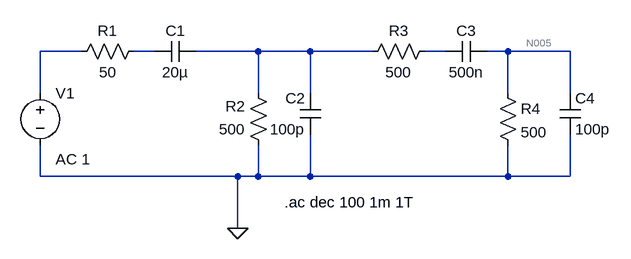
[diagram p0: schematic Question_1.asc]
Question_1.asc, the LTspice schematic file:
Version 4
SHEET 1 1124 680
WIRE 304 160 240 160
WIRE 416 160 384 160
WIRE 576 160 480 160
WIRE 656 160 576 160
WIRE 752 160 656 160
WIRE 864 160 832 160
WIRE 960 160 928 160
WIRE 1056 160 960 160
WIRE 240 224 240 160
WIRE 576 224 576 160
WIRE 656 224 656 160
WIRE 960 224 960 160
WIRE 1056 224 1056 160
WIRE 240 352 240 304
WIRE 544 352 240 352
WIRE 576 352 576 304
WIRE 576 352 544 352
WIRE 656 352 656 288
WIRE 656 352 576 352
WIRE 960 352 960 304
WIRE 960 352 656 352
WIRE 1056 352 1056 288
WIRE 1056 352 960 352
WIRE 544 432 544 352
FLAG 544 432 0
SYMBOL res 400 144 R90
WINDOW 0 0 56 VBottom 2
WINDOW 3 32 56 VTop 2
SYMATTR InstName R1
SYMATTR Value 50
SYMBOL res 592 320 R180
WINDOW 0 36 76 Left 2
WINDOW 3 36 40 Left 2
SYMATTR InstName R2
SYMATTR Value 500
SYMBOL res 736 176 R270
WINDOW 0 32 56 VTop 2
WINDOW 3 0 56 VBottom 2
SYMATTR InstName R3
SYMATTR Value 500
SYMBOL res 944 208 R0
SYMATTR InstName R4
SYMATTR Value 500
SYMBOL voltage 240 208 R0
WINDOW 123 24 118 Left 2
SYMATTR InstName V1
SYMATTR Value ""
SYMATTR Value2 AC 1
SYMBOL cap 480 144 R90
WINDOW 0 0 32 VBottom 2
WINDOW 3 32 32 VTop 2
SYMATTR InstName C1
SYMATTR Value 20µ
SYMBOL cap 672 288 R180
WINDOW 0 24 56 Left 2
WINDOW 3 24 8 Left 2
SYMATTR InstName C2
SYMATTR Value 100p
SYMBOL cap 864 176 R270
WINDOW 0 32 32 VTop 2
WINDOW 3 0 32 VBottom 2
SYMATTR InstName C3
SYMATTR Value 500n
SYMBOL cap 1040 224 R0
SYMATTR InstName C4
SYMATTR Value 100p
TEXT 616 392 Left 2 !.ac dec 100 1m 1T

The netlist it stands for:
* Question_1.asc
R1 N002 N001 50
R2 0 N003 500
R3 N003 N004 500
R4 N005 0 500
V1 N001 0 AC 1
C1 N003 N002 20µ
C2 0 N003 100p
C3 N004 N005 500n
C4 N005 0 100p
.ac dec 100 1m 1T
.backanno
.end

* Results of the author's LTspice run, read from the files saved beside the schematic
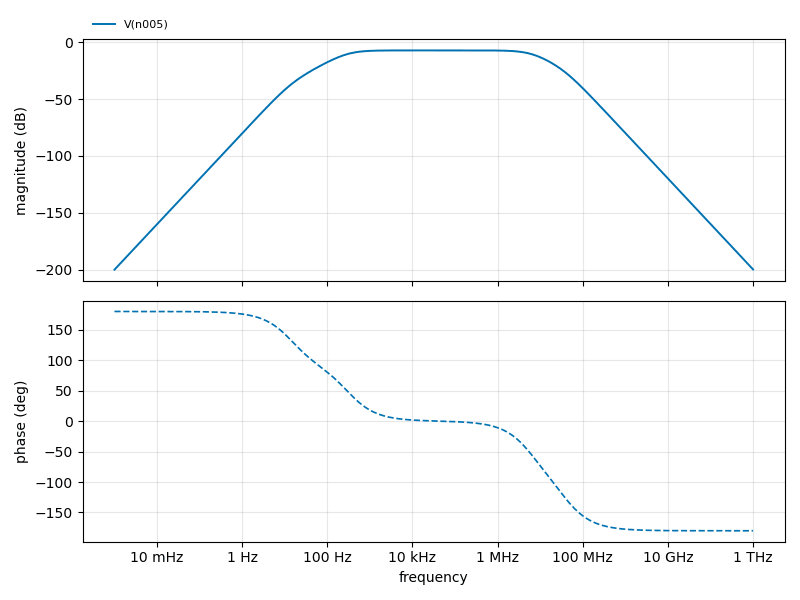
[diagram p1: AC Analysis of Question_1.asc, plotted from the saved traces]
* AC Analysis, 1 run:
*   V(n005): -200.11 dB at 1 mHz, -199.89 dB at 1 THz, peak -7.24 dB at 42.66 kHz, 3 dB below the peak at 311.7 Hz and 5.911 MHz